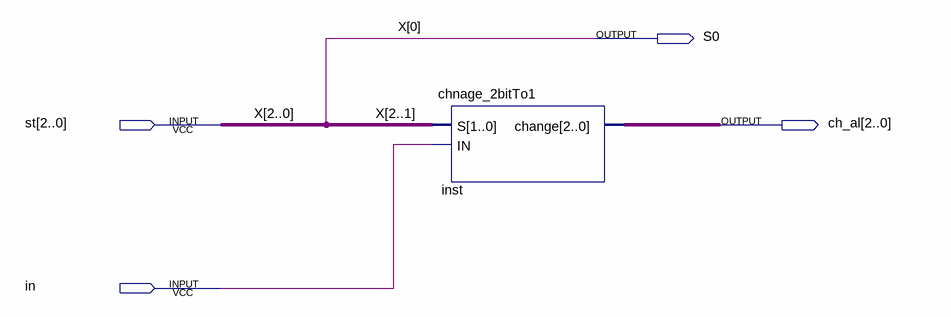
[diagram p0: schematic sheet]
// Quartus schematic chnage_3bit.bdf as structural Verilog: 1 symbols, 4 pins
module chnage_3bit (
  input  [2:0] st,
  input  in,
  output S0,
  output [2:0] ch_al
);

  chnage_2bitTo1 inst (.S(st[2:1]), .IN(in), .change(ch_al));

  assign S0 = st[0];

  // Other names for the same wires on the sheet: X[2:0] = st
endmodule
